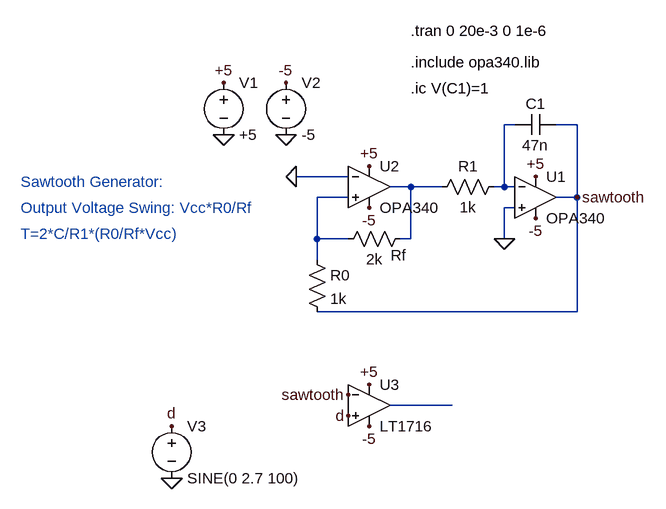
[diagram p0: schematic pwm_generator.asc]
pwm_generator.asc, the LTspice schematic file:
Version 4
SHEET 1 880 680
WIRE 64 16 48 16
WIRE 160 16 128 16
WIRE -192 96 -272 96
WIRE -96 112 -128 112
WIRE -48 112 -96 112
WIRE 48 112 48 16
WIRE 48 112 32 112
WIRE 64 112 48 112
WIRE -192 128 -240 128
WIRE 160 128 160 16
WIRE 160 128 128 128
WIRE 64 144 48 144
WIRE -240 192 -240 128
WIRE -192 192 -240 192
WIRE -96 192 -96 112
WIRE -96 192 -112 192
WIRE 48 192 48 144
WIRE -240 224 -240 192
WIRE 160 304 160 128
WIRE 160 304 -240 304
WIRE -32 448 -128 448
FLAG -384 32 0
FLAG -288 32 0
FLAG -384 -48 +5
FLAG -288 -48 -5
FLAG 96 160 -5
FLAG 96 96 +5
FLAG -272 96 0
FLAG -160 80 +5
FLAG -160 144 -5
FLAG 48 192 0
FLAG 160 128 sawtooth
FLAG -464 560 0
FLAG -160 416 +5
FLAG -464 480 d
FLAG -192 464 d
FLAG -192 432 sawtooth
FLAG -160 480 -5
SYMBOL OpAmps\\opamp2 96 64 R0
SYMATTR InstName U1
SYMATTR Value OPA340
SYMBOL voltage -384 -64 R0
WINDOW 123 0 0 Left 0
WINDOW 39 0 0 Left 0
SYMATTR InstName V1
SYMATTR Value +5
SYMBOL voltage -288 -64 R0
WINDOW 123 0 0 Left 0
WINDOW 39 0 0 Left 0
SYMATTR InstName V2
SYMATTR Value -5
SYMBOL res 48 96 R90
WINDOW 0 0 56 VBottom 2
WINDOW 3 32 56 VTop 2
SYMATTR InstName R1
SYMATTR Value 1k
SYMBOL cap 128 0 R90
WINDOW 0 0 32 VBottom 2
WINDOW 3 32 32 VTop 2
SYMATTR InstName C1
SYMATTR Value 47n
SYMBOL OpAmps\\opamp2 -160 48 R0
SYMATTR InstName U2
SYMATTR Value OPA340
SYMBOL res -256 208 R0
SYMATTR InstName R0
SYMATTR Value 1k
SYMBOL res -96 176 R90
WINDOW 0 57 19 VBottom 2
WINDOW 3 32 56 VTop 2
SYMATTR InstName Rf
SYMATTR Value 2k
SYMBOL voltage -464 464 R0
WINDOW 123 0 0 Left 0
WINDOW 39 0 0 Left 0
SYMATTR InstName V3
SYMATTR Value SINE(0 2.7 100)
SYMBOL Comparators\\LT1716 -160 448 R0
SYMATTR InstName U3
TEXT -96 -80 Left 2 !.include opa340.lib
TEXT -96 -128 Left 2 !.tran 0 20e-3 0 1e-6
TEXT -96 -40 Left 2 !.ic V(C1)=1
TEXT -696 104 Left 2 ;Sawtooth Generator:
TEXT -696 144 Left 2 ;Output Voltage Swing: Vcc*R0/Rf
TEXT -696 184 Left 2 ;T=2*C/R1*(R0/Rf*Vcc)

The netlist it stands for:
* pwm_generator.asc
XU1 0 N001 +5 -5 sawtooth OPA340  ; pins In+ In- V+ V- OUT
V1 +5 0 +5
V2 -5 0 -5
R1 N001 N002 1k
C1 sawtooth N001 47n
XU2 N003 0 +5 -5 N002 OPA340  ; pins In+ In- V+ V- OUT
R0 N003 sawtooth 1k
Rf N002 N003 2k
V3 d 0 SINE(0 2.7 100)
XU3 d sawtooth +5 -5 N004 LT1716  ; pins In+ In- V+ V- OUT
.include opa340.lib
.tran 0 20e-3 0 1e-6
.ic V(C1)=1
* Sawtooth Generator:
* Output Voltage Swing: Vcc*R0/Rf
* T=2*C/R1*(R0/Rf*Vcc)
.lib LTC1.lib
.backanno
.end